# EAGLE design Aquaduino_mega32_u4_v1.5 (EAGLE 7.5.0)
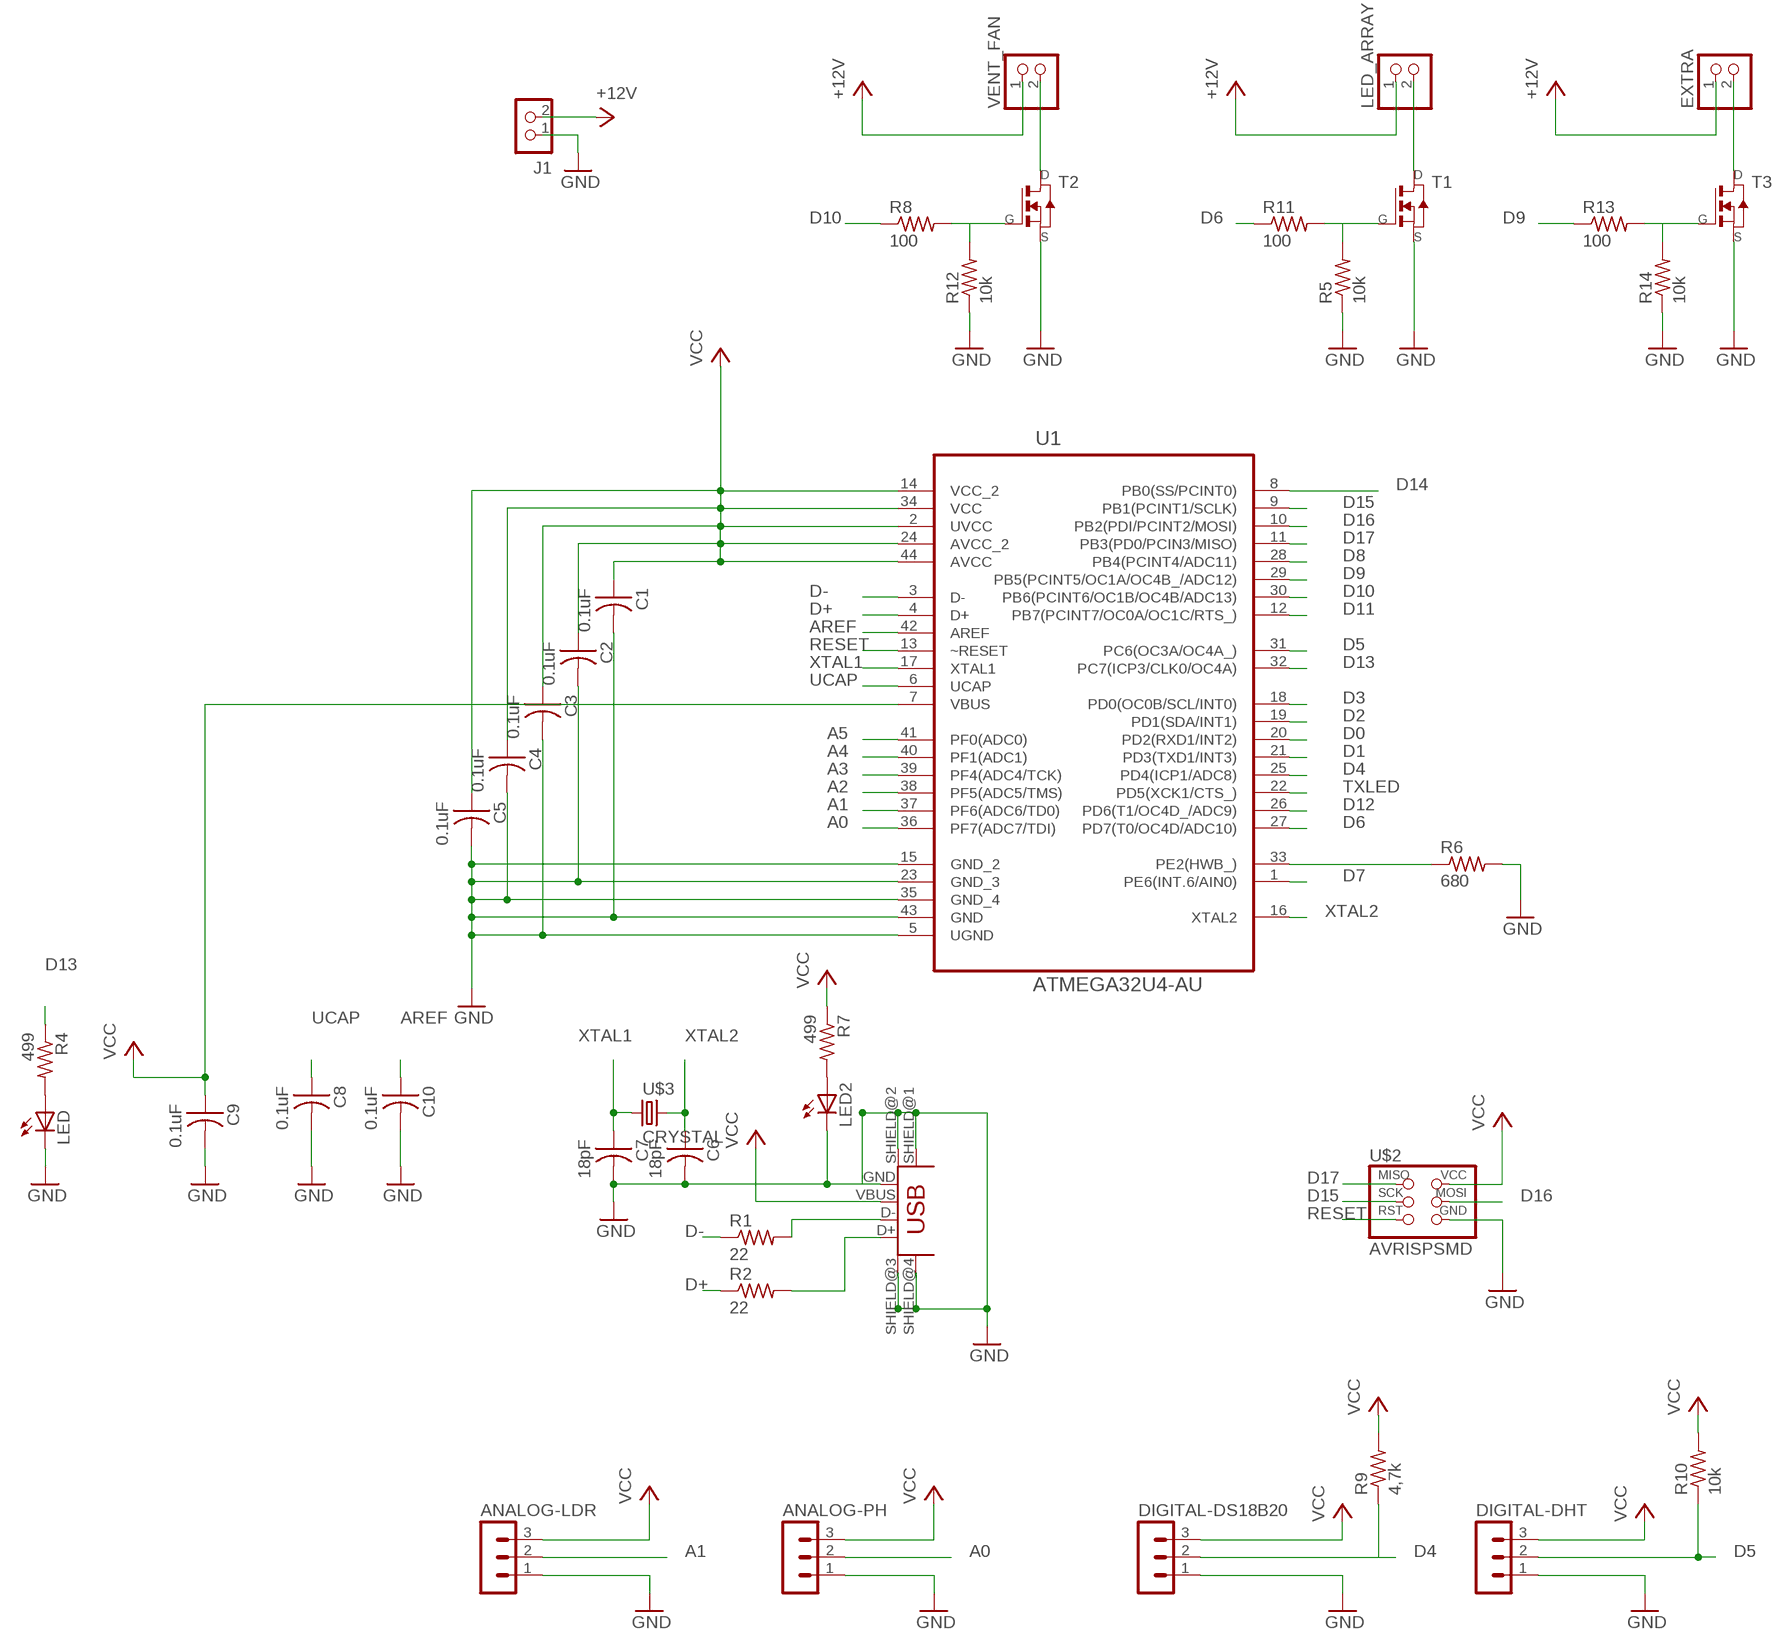
[diagram p0: schematic, sheet 1]

## Parts
ANALOG-LDR  MA03-1  [MA03-1]
ANALOG-PH  MA03-1  [MA03-1]
C1  0.1uF  CAP-US1206FAB  [C1206FAB]
C2  0.1uF  CAP-US1206FAB  [C1206FAB]
C3  0.1uF  CAP-US1206FAB  [C1206FAB]
C4  0.1uF  CAP-US1206FAB  [C1206FAB]
C5  0.1uF  CAP-US1206FAB  [C1206FAB]
C6  18pF  CAP-US1206FAB  [C1206FAB]
C7  18pF  CAP-US1206FAB  [C1206FAB]
C8  0.1uF  CAP-US1206FAB  [C1206FAB]
C9  0.1uF  CAP-US1206FAB  [C1206FAB]
C10  0.1uF  CAP-US1206FAB  [C1206FAB]
DIGITAL-DHT  MA03-1  [MA03-1]
DIGITAL-DS18B20  MA03-1  [MA03-1]
EXTRA  PINHD-1X2  [1X02]
J1  CON_TERMINAL_BLOCK_02-5MM  [TERMINAL_BLOCK_2P_5]
LED  LED1206  [1206]
LED2  LED1206  [1206]
LED_ARRAY  PINHD-1X2  [1X02]
R1  22  RES-US1206FAB  [R1206FAB]
R2  22  RES-US1206FAB  [R1206FAB]
R4  499  RESISTOR1206  [1206]
R5  10k  RES-US1206FAB  [R1206FAB]
R6  680  RES-US1206FAB  [R1206FAB]
R7  499  RESISTOR1206  [1206]
R8  100  RES-US1206FAB  [R1206FAB]
R9  4,7k  RES-US1206FAB  [R1206FAB]
R10  10k  RES-US1206FAB  [R1206FAB]
R11  100  RES-US1206FAB  [R1206FAB]
R12  10k  RES-US1206FAB  [R1206FAB]
R13  100  RES-US1206FAB  [R1206FAB]
R14  10k  RES-US1206FAB  [R1206FAB]
T1  NMOSFETTO252  [TO252]
T2  NMOSFETTO252  [TO252]
T3  NMOSFETTO252  [TO252]
U1  ATMEGA32U4-AU  [QFP80P1200X1200X120-44N]
U$1  USB_MINIB  [USB_MINIB]
U$2  AVRISPSMD  [2X03SMD]
U$3  CRYSTAL  [2-SMD-5X3MM]
VENT_FAN  PINHD-1X2  [1X02]

## Nets
A0: ANALOG-PH.2 U1.36(PF7(ADC7/TDI))
A1: ANALOG-LDR.2 U1.37(PF6(ADC6/TD0))
A2: U1.38(PF5(ADC5/TMS))
A3: U1.39(PF4(ADC4/TCK))
A4: U1.40(PF1(ADC1))
A5: U1.41(PF0(ADC0))
AREF: C10.1 U1.42(AREF)
D0: U1.20(PD2(RXD1/INT2))
D1: U1.21(PD3(TXD1/INT3))
D2: U1.19(PD1(SDA/INT1))
D3: U1.18(PD0(OC0B/SCL/INT0))
D4: DIGITAL-DS18B20.2 R9.1 U1.25(PD4(ICP1/ADC8))
D5: DIGITAL-DHT.2 R10.1 U1.31(PC6(OC3A/OC4A_))
D6: R11.1 U1.27(PD7(T0/OC4D/ADC10))
D7: U1.1(PE6(INT.6/AIN0))
D8: U1.28(PB4(PCINT4/ADC11))
D9: R13.1 U1.29(PB5(PCINT5/OC1A/OC4B_/ADC12))
D10: R8.1 U1.30(PB6(PCINT6/OC1B/OC4B/ADC13))
D11: U1.12(PB7(PCINT7/OC0A/OC1C/RTS_))
D12: U1.26(PD6(T1/OC4D_/ADC9))
D13: R4.1 U1.32(PC7(ICP3/CLK0/OC4A))
D14: U1.8(PB0(SS/PCINT0))
D15: U1.9(PB1(PCINT1/SCLK)) U$2.3(SCK)
D16: U1.10(PB2(PDI/PCINT2/MOSI)) U$2.4(MOSI)
D17: U1.11(PB3(PD0/PCIN3/MISO)) U$2.1(MISO)
D+: R2.1 U1.4(D+)
D-: R1.1 U1.3(D-)
GND: ANALOG-LDR.1 ANALOG-PH.1 C1.2 C2.2 C3.2 C4.2 C5.2 C6.2 C7.2 C8.2 C9.2 C10.2 DIGITAL-DHT.1 DIGITAL-DS18B20.1 J1.1 LED2.2(C) LED.2(C) R5.1 R6.2 R12.1 R14.1 T1.2(S) T2.2(S) T3.2(S) U1.5(UGND) U1.15(GND_2) U1.23(GND_3) U1.35(GND_4) U1.43(GND) U$1.GND U$1.SHIELD@1(SHIELD) U$1.SHIELD@2(SHIELD1) U$1.SHIELD@3(SHIELD2) U$1.SHIELD@4(SHIELD3) U$2.6(GND)
N$1: R1.2 U$1.D-
N$2: R2.2 U$1.D+
N$3: LED.1(A) R4.2
N$4: R8.2 R12.2 T2.1(G)
N$5: LED2.1(A) R7.2
N$6: T2.3(D) VENT_FAN.2
N$7: R13.2 R14.2 T3.1(G)
N$8: R5.2 R11.2 T1.1(G)
N$9: LED_ARRAY.2 T1.3(D)
N$10: EXTRA.2 T3.3(D)
N$35: R6.1 U1.33(PE2(HWB_))
RESET: U1.13(~RESET) U$2.5(RST)
TXLED: U1.22(PD5(XCK1/CTS_))
UCAP: C8.1 U1.6(UCAP)
VCC: ANALOG-LDR.3 ANALOG-PH.3 C1.1 C2.1 C3.1 C4.1 C5.1 C9.1 DIGITAL-DHT.3 DIGITAL-DS18B20.3 EXTRA.1 J1.2 LED_ARRAY.1 R7.1 R9.2 R10.2 U1.2(UVCC) U1.7(VBUS) U1.14(VCC_2) U1.24(AVCC_2) U1.34(VCC) U1.44(AVCC) U$1.VBUS U$2.2(VCC) VENT_FAN.1 ; supply symbol labelled +12V
XTAL1: C7.1 U1.17(XTAL1) U$3.P$1
XTAL2: C6.1 U1.16(XTAL2) U$3.P$2

## Library data of the parts
ANALOG-LDR ANALOG-PH DIGITAL-DHT DIGITAL-DS18B20 = con-lstb:MA03-1: PIN HEADER; OC_FARNELL: unknown; OC_NEWARK: unknown
C1-C10 = fab:CAP-US
EXTRA LED_ARRAY VENT_FAN = pinhead:PINHD-1X2: PIN HEADER
J1 = dp_devices:CON_TERMINAL_BLOCK_02: 2 poles wire to board terminal block
LED LED2 = ng:LED
R1 R2 R5 R6 R8-R14 = fab:RES-US: Resistor (US Symbol) Variants with postfix FAB are widened to allow the routing of internal traces
R4 R7 = ng:RESISTOR
T1-T3 = fab:NMOSFET: MOS FET
U1 = Atmel_By_element14_Batch_1:ATMEGA32U4-AU: 8-bit Microcontroller with ISP Flash and USB Controller; MPN: ATMEGA32U4-AU; OC_FARNELL: 1748525; OC_NEWARK: 26R5633; PACKAGE: TQFP-44; SUPPLIER: Atmel
U$1 = fab:USB_MINIB
U$2 = fab:AVRISP
U$3 = fab:CRYSTAL

## Net classes
0 default: width 0.254 mm, drill 0.406 mm, clearance 0.254 mm

## Board
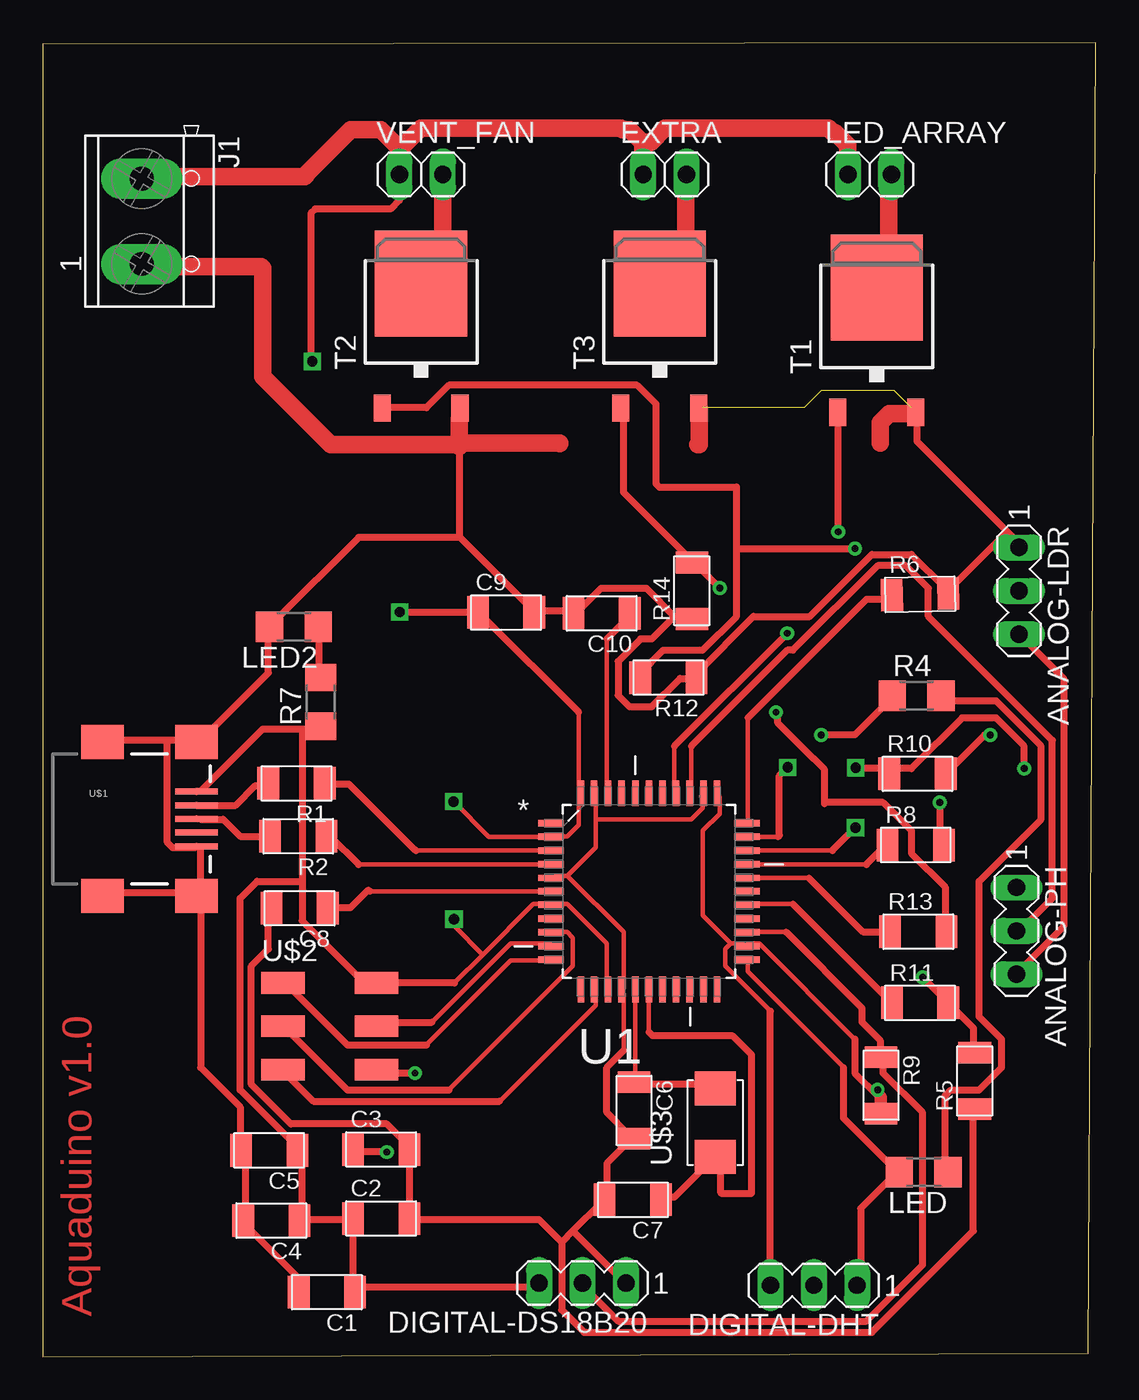
[diagram p1: board, top side]
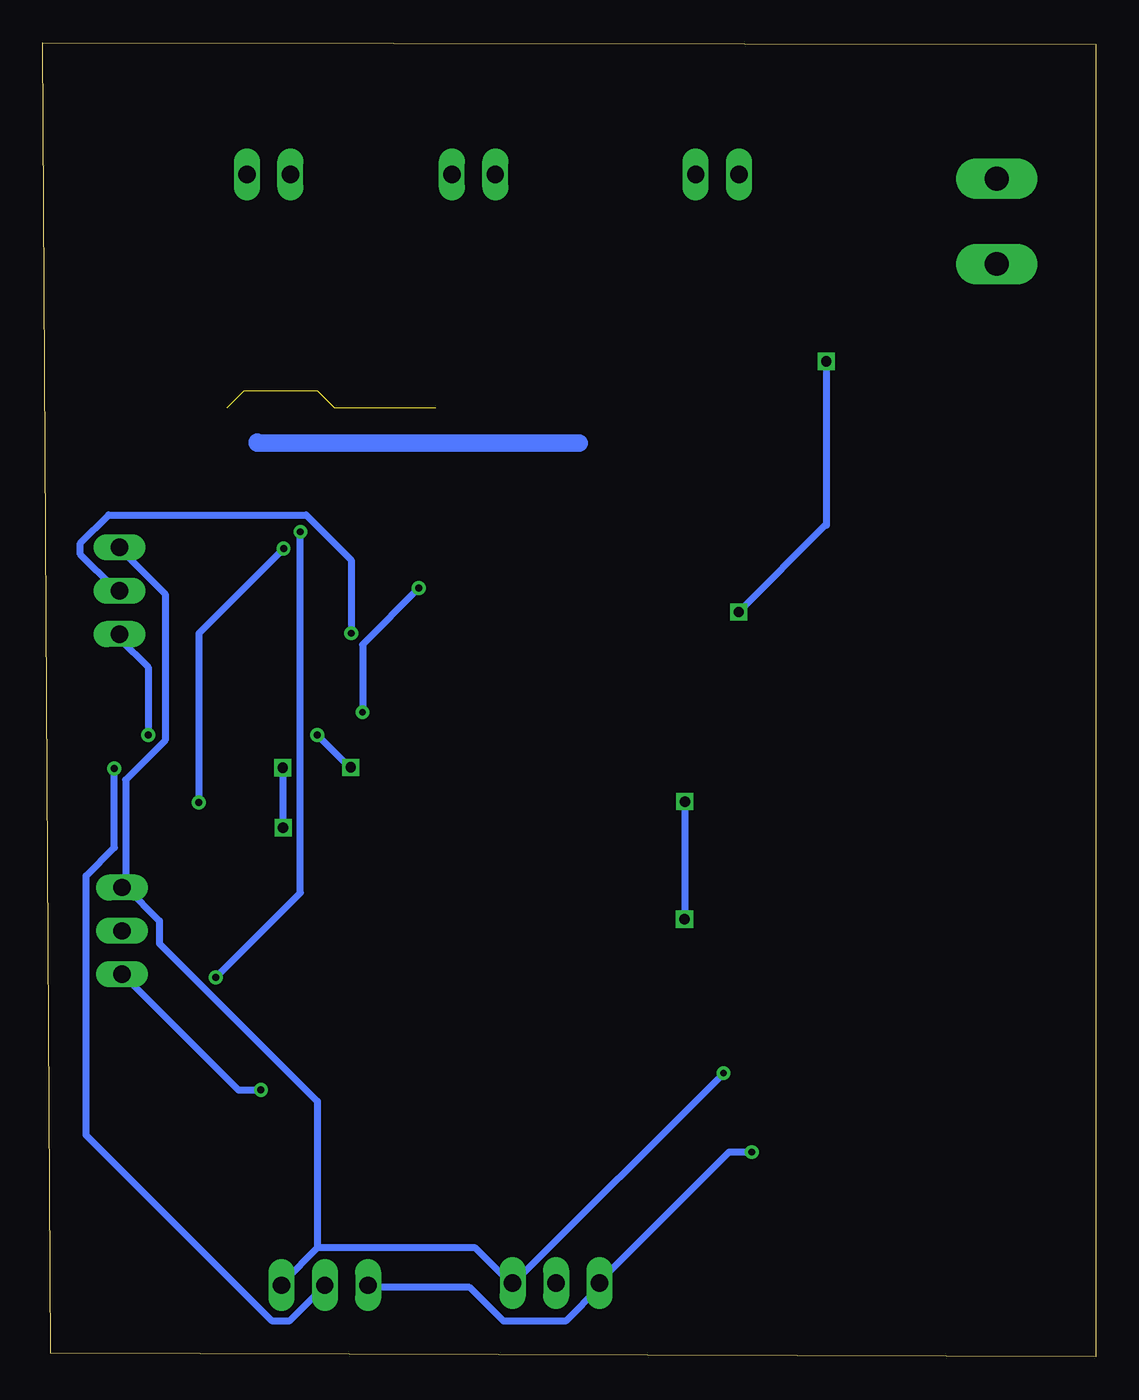
[diagram p2: board, bottom side, seen from below]

Size 61.65 x 76.95 mm. Coordinates in mm from the lower left corner, seen from the top.
Outline: 0,0 61.19,0.2 61.65,76.95 0,76.85 0,0
Copper layers (1*16): Top 0.035mm / dielectric 1.5mm / Bottom 0.035mm
Design rules "default *": minimum track width 10mil, minimum drill 16mil, track to track 10mil, track to pad 10mil, pad to pad 10mil, via to via 10mil, smd to smd 10mil, copper to edge 40mil, drill to drill 10mil, minimum pad ring 10mil, minimum via ring 8mil, stop-mask expansion 4mil, vias tented up to drill 0mil, thermal gap 10mil

### Footprints (pad centres in the part's own frame; a part is rotated, then mirrored left to right if it is on the bottom)
MA03-1 = drill 1.016 long: 1 -2.54,0; 2 0,0; 3 2.54,0
C1206FAB = smd 1.27 x 1.905: 1 -1.651,0; 2 1.651,0
1X02 = drill 1.016 long: 1 -1.27,0; 2 1.27,0
TERMINAL_BLOCK_2P_5 = drill 1.4 pad 2.38 long: 1 2.5,-0.45; 2 -2.5,-0.45
1206 = smd 1.6 x 1.803: 1 -1.422,0; 2 1.422,0
R1206FAB = smd 1.27 x 1.905: 1 -1.651,0; 2 1.651,0
TO252 = smd 1 x 1.6: 1 -2.28,-4.8; 2 2.28,-4.8 | smd 5.4 x 6.2: 3 0,2.5
QFP80P1200X1200X120-44N = smd 1.5 x 0.38: 1 -5.74,3.988; 2 -5.74,3.2; 3 -5.74,2.388; 4 -5.74,1.6; 5 -5.74,0.787; 6 -5.74,0; 7 -5.74,-0.787; 8 -5.74,-1.6; 9 -5.74,-2.388; 10 -5.74,-3.2; 11 -5.74,-3.988; 23 5.74,-3.988; 24 5.74,-3.2; 25 5.74,-2.388; 26 5.74,-1.6; 27 5.74,-0.787; 28 5.74,0; 29 5.74,0.787; 30 5.74,1.6; 31 5.74,2.388; 32 5.74,3.2; 33 5.74,3.988 | smd 0.38 x 1.5: 12 -3.988,-5.74; 13 -3.2,-5.74; 14 -2.388,-5.74; 15 -1.6,-5.74; 16 -0.787,-5.74; 17 0,-5.74; 18 0.787,-5.74; 19 1.6,-5.74; 20 2.388,-5.74; 21 3.2,-5.74; 22 3.988,-5.74; 34 3.988,5.74; 35 3.2,5.74; 36 2.388,5.74; 37 1.6,5.74; 38 0.787,5.74; 39 0,5.74; 40 -0.787,5.74; 41 -1.6,5.74; 42 -2.388,5.74; 43 -3.2,5.74; 44 -3.988,5.74
USB_MINIB = smd 2.5 x 0.35: D+ 3.77,0; D- 3.77,0.8; GND 3.77,-1.6; ID 3.77,-0.8; VBUS 3.77,1.6 | smd 2.5 x 2: SHIELD@1 -1.73,-4.5; SHIELD@2 -1.73,4.5; SHIELD@3 3.77,4.5; SHIELD@4 3.77,-4.5
2X03SMD = smd 2.54 x 1.27: 1 -2.54,2.54; 2 2.92,2.54; 3 -2.54,0; 4 2.92,0; 5 -2.54,-2.54; 6 2.92,-2.54
2-SMD-5X3MM = smd 2 x 2.4: P$1 -2,0; P$2 2,0

### Placement (x,y rotation side)
ANALOG-LDR  57.15,44.86 270 top
ANALOG-PH  57,24.94 270 top
C1  16.64,3.78 180 top
C2  19.81,8.1 0 top
C3  19.81,12.14 0 top
C4  13.39,7.98 180 top
C5  13.26,12.09 180 top
C6  34.62,14.43 270 top
C7  34.54,9.19 180 top
C8  15.04,26.26 180 top
C9  27.13,43.59 0 top
C10  32.72,43.54 180 top
DIGITAL-DHT  45.14,4.19 180 top
DIGITAL-DS18B20  31.6,4.32 180 top
EXTRA  36.42,69.24 0 top
J1  6.25,66.5 270 top
LED  51.56,10.82 180 top
LED2  14.71,42.75 180 top
LED_ARRAY  48.41,69.24 0 top
R1  14.86,33.58 180 top
R2  14.96,30.48 180 top
R4  51.16,38.71 0 top
R5  54.56,16.15 90 top
R6  51.36,44.65 1.2 top
R7  16.28,38.35 90 top
R8  51.1,29.97 0 top
R9  49.07,15.9 270 top
R10  51.21,34.14 0 top
R11  51.36,20.73 0 top
R12  36.63,39.78 180 top
R13  51.26,24.89 0 top
R14  38,44.86 90 top
T1  48.82,60.1 0 top
T2  22.15,60.35 0 top
T3  36.12,60.35 0 top
U1  35.48,27.25 0 top
U$1  5.23,31.5 0 top
U$2  16.61,19.35 0 top
U$3  39.37,13.72 90 top
VENT_FAN  22.15,69.24 0 top

### Tracks (layer width: path | path; a pad name or v marks a point on that pad's centre or on a via)
A0
  Top 0.254: 37.97,35.76 37.97,33.12 U1.36
  Top 0.406: 37.97,35.76 43.59,41.38 43.92,41.38 48.87,46.33 50.52,46.33 51.84,45.01 51.84,43.36 59.11,36.09 59.11,26.85 57.12,24.87 ANALOG-PH.2
A1  (via drill 0.41)
  Top 0.254: 36.98,35.76 36.98,33.12 U1.37
  Top 0.406: v43.59,42.37 36.98,35.76
  Bottom 0.406: v43.59,42.37 43.59,46.66 46.23,49.3 57.78,49.3 59.44,47.65 59.44,46.99 57.45,45.01 ANALOG-LDR.2
AREF
  Top 0.254: 33.02,42.04 33.02,33.12 U1.42
  Top 0.406: 33.02,42.04 34.34,43.36 C10.1
D4
  Top 0.254: U1.25 43.51,24.87
  Top 0.406: DIGITAL-DS18B20.2 31.7,4.06 33.68,2.08 48.21,2.08 51.51,5.38 51.51,14.3 49.2,16.61 49.2,17.27 R9.1 49.02,17.6 49.02,18.54 47.95,19.61 47.95,20.42 43.51,24.87
D5  (via drill 0.41, 0.6)
  Top 0.254: U1.31 46.23,29.64
  Top 0.406: v57.45,34.44 57.45,35.76 55.8,37.41 53.82,37.41 50.85,34.44 49.86,34.44 R10.1 49.2,34.49 v47.6,34.49 | 46.23,29.64 v47.57,30.99
  Bottom 0.406: v57.45,34.44 57.45,29.82 59.11,28.17 59.11,12.98 48.21,2.08 47.22,2.08 45.24,4.06 DIGITAL-DHT.2 | v47.57,30.99 47.57,34.47 v47.6,34.49
D6
  Top 0.254: 43.92,26.52 41.27,26.52 U1.27
  Top 0.406: R11.1 43.92,26.52
D9
  Top 0.254: U1.29 44.86,28.04
  Top 0.406: 44.86,28.04 48.01,24.89 R13.1
D10
  Top 0.254: 48.21,28.83 41.27,28.83
  Top 0.406: 48.21,28.83 49.2,29.82 R8.1 | 41.27,28.83 U1.30
D13  (via drill 0.41, 0.6)
  Top 0.254: U1.32 43.05,30.45
  Top 0.406: v45.57,36.42 47.55,36.42 49.53,38.4 R4.1 | 43.05,30.45 43.13,30.53 43.13,34.04 v43.61,34.52
  Bottom 0.406: v43.61,34.52 43.66,34.52 v45.57,36.42
D15
  Top 0.254: U1.9 30.71,24.87 31.04,24.54 31.04,22.89 23.77,15.62
  Top 0.406: 23.77,15.62 17.83,15.62 14.2,19.25 U$2.3
D16
  Top 0.254: 22.78,19.58 27.41,24.21 29.72,24.21 U1.10
  Top 0.406: 22.78,19.58 19.81,19.58 U$2.4
D17
  Top 0.254: 29.72,23.22 27.41,23.22 22.45,18.26
  Top 0.406: 22.45,18.26 17.83,18.26 14.2,21.89 U$2.1 | 29.72,23.22 U1.11
D+
  Top 0.254: 18.49,28.83 29.72,28.83
  Top 0.406: 18.49,28.83 16.84,30.48 R2.1 | 29.72,28.83 U1.4
D-
  Top 0.254: U1.3 21.84,29.64
  Top 0.406: 21.84,29.64 21.79,29.69 21.77,29.69 17.93,33.53 16.56,33.53 R1.1
GND  (via drill 0.41)  (4 unrouted)
  Top 0.254: 41.27,23.22 41.27,22.55 46.89,16.94 | 30.71,28.17 30.05,28.17 U1.5 | 30.71,28.17 32.36,29.82 32.36,31.47 | 32.36,31.47 32.36,32.79 U1.43 | 30.71,28.17 34.01,24.87 34.01,21.56 U1.15 34.01,21.23 34.01,17.93 | 38.63,32.79 38.63,32.13 37.97,31.47 32.36,31.47
  Top 0.406: 46.89,16.94 46.89,13.97 49.86,11 LED.2 49.86,10.67 47.88,8.69 47.88,4.39 DIGITAL-DHT.1 | 41.27,23.22 U1.23 | v21.79,16.61 19.81,16.61 U$2.6 | C8.2 13.21,26.19 13.21,23.88 12.22,22.89 12.22,15.95 14.53,13.64 20.14,13.64 21.46,12.32 C3.2 C2.2 21.46,8.03 29.06,8.03 30.38,6.71 | 38.63,32.79 U1.35 | 30.38,6.71 30.38,2.74 31.7,1.42 48.54,1.42 54.48,7.37 54.48,14.3 R5.1 | 31.04,7.37 32.69,9.02 C7.2 33.02,9.35 33.02,11.33 34.34,12.65 C6.2 34.34,12.98 33.02,14.3 33.02,16.94 34.01,17.93 | 31.04,7.37 30.38,6.71 | 31.04,7.37 34.01,4.39 DIGITAL-DS18B20.1 | C1.2 14.86,4.06 14.86,4.72 11.89,7.7 C4.2 11.89,8.03 11.89,11.99 C5.2 11.56,12.32 11.56,14.63 9.25,16.94 9.25,26.85 U$1.SHIELD@4 | U$1.SHIELD@1 3.63,27.18 8.92,27.18 U$1.SHIELD@4 | U$1.SHIELD@4 9.25,27.18 9.25,29.82 U$1.GND 8.92,29.82 7.59,29.82 7.26,30.15 7.26,36.09 | 7.26,36.09 8.92,36.09 U$1.SHIELD@3 9.25,36.09 13.21,40.06 13.21,42.7 LED2.2 13.54,43.03 18.49,47.98 24.43,47.98 | 7.26,36.09 3.63,36.09 U$1.SHIELD@2 | 56.46,48.31 57.12,47.65 ANALOG-LDR.1 | 56.46,48.31 51.18,53.59 51.18,55.24 T1.2 50.85,55.57 | 38.63,55.57 T3.2 | 56.46,48.31 53.16,45.01 R6.2 52.83,45.01 50.85,46.99 48.54,46.99 44.91,43.36 41.6,43.36 38.3,40.06 R12.1 37.97,39.73 37.31,39.73 35.66,38.07 34.34,38.07 33.68,38.73 33.68,40.72 35,42.04 35.66,42.04 36.98,43.36 | 24.43,54.97 24.43,55.24 T2.2 | 24.43,47.98 28.73,43.69 C9.2 29.06,43.69 31.04,43.69 C10.2 31.37,43.69 32.69,45.01 35.33,45.01 36.98,43.36 | 36.98,43.36 37.97,43.36 R14.1 | 24.38,53.31 24.38,48.03 24.43,47.98
  Top 1.016: J1.1 5.94,63.83 12.8,63.83 12.88,63.75 12.88,57.4 16.87,53.42 24.28,53.42 24.38,53.31 24.38,54.91 24.43,54.97
  Bottom 0.406: v21.79,16.61 34.01,4.39 DIGITAL-DS18B20.1 34.34,4.39 36.32,6.38 45.57,6.38 | 45.57,6.38 47.55,4.39 DIGITAL-DHT.1 | 56.79,27.51 56.79,33.78 54.48,36.09 54.48,44.68 57.12,47.32 ANALOG-LDR.1 | 45.57,6.38 45.57,14.96 54.81,24.21 54.81,25.53 56.79,27.51 | 56.79,27.51 ANALOG-PH.1
N$1
  Top 0.406: U$1.D- 11.29,32.3 12.45,33.45 13.08,33.45 R1.2
N$2
  Top 0.406: R2.2 11.56,30.48 10.57,31.47 9.25,31.47 U$1.D+
N$3
  Top 0.406: R4.2 52.83,38.4 55.8,38.4 58.44,35.76 58.44,31.47 54.81,27.84 54.81,19.91 56.13,18.59 56.13,16.94 54.81,15.62 53.16,15.62 52.83,15.29 52.83,11 LED.1
N$4  (via drill 0.41)
  Top 0.406: 40.61,47.32 40.61,43.36 38.63,41.38 36.32,41.38 35,40.06 R12.2 | 40.61,47.32 40.61,50.95 40.59,50.93 36.09,50.93 35.89,51.13 35.89,55.8 34.8,56.9 23.77,56.9 22.45,55.57 20.14,55.57 T2.1 | v52.5,32.46 52.5,30.15 R8.2 | 40.61,47.32 v47.55,47.32
  Bottom 0.406: v52.5,32.46 52.5,42.37 v47.55,47.32
N$5
  Top 0.406: LED2.1 16.18,42.7 16.18,40.06 R7.2
N$6
  Top 1.016: VENT_FAN.2 23.42,63.12 23.17,62.86 22.16,62.86 T2.3
N$7  (via drill 0.41)
  Top 0.406: T3.1 34.01,55.24 34.01,50.62 37.97,46.66 R14.2 38.3,46.33 v39.62,45.01 | R13.2 52.83,25.2 52.83,27.51 50.85,29.49 50.85,30.81 49.2,32.46 45.85,32.46 45.77,32.38 45.77,34.39 45.14,35.03 45.11,35.03 43.03,37.11 43.03,37.64 v42.93,37.74
  Bottom 0.406: v42.93,37.74 42.93,41.71 v39.62,45.01
N$8  (via drill 0.41)
  Top 0.406: v46.56,48.31 46.56,55.24 T1.1 | v51.51,22.22 R11.2 54.48,19.25 54.48,17.93 R5.2
  Bottom 0.406: v46.56,48.31 46.56,27.18 v51.51,22.22
N$9
  Top 0.406: 49.53,63.5 48.87,62.84 T1.3 | 49.53,69.11 LED_ARRAY.2
  Top 1.016: 49.53,69.11 49.53,63.5
N$10
  Top 0.406: 37.64,64.49 36.32,63.17 T3.3 | 37.64,69.11 EXTRA.2
  Top 1.016: 37.64,69.11 37.64,64.49
N$13
  Top 1.016: 24.36,53.49 30.28,53.49 30.28,53.47
N$15
  Bottom 1.016: 30.25,53.52 49.1,53.52 49.1,53.57
N$16
  Top 1.016: 38.35,53.42 38.43,53.42 38.43,55.55
N$17
  Top 1.016: 49.02,53.52 49.02,54.71 49.55,55.24 51.03,55.24
N$35
  Top 0.254: 41.27,37.41 41.27,31.14 U1.33
  Top 0.406: 41.27,37.41 48.21,44.35 49.53,44.35 R6.1
RESET
  Top 0.254: 26.75,14.96 32.36,20.57 32.36,21.23 U1.13
  Top 0.406: 26.75,14.96 15.85,14.96 14.2,16.61 U$2.5
UCAP
  Top 0.254: U1.6 19.15,27.25
  Top 0.406: 19.15,27.25 19.1,27.3 19.03,27.3 18.01,26.29 16.71,26.29 C8.1
VCC  (via drill 0.41, 0.6)
  Top 0.254: U1.14 33.02,21.56 33.02,24.21 30.71,26.52 30.05,26.52 U1.7 29.72,26.52 28.73,26.52 25.76,23.55 | 25.76,23.55 24.11,21.89 | 30.05,30.48 30.71,30.48 31.37,31.14 31.37,32.79 U1.44 31.37,33.12 31.37,37.74 | 40.28,24.21 38.63,25.86 38.63,30.81 39.62,31.8 39.62,32.79 U1.34 | 40.28,24.21 40.94,24.21 U1.24 41.27,24.21 41.94,24.21 47.55,18.59 | 40.28,24.21 39.95,23.88 39.95,22.89 42.6,20.24 | U1.2 26.11,30.45 v24.05,32.51 | v24.08,25.63 24.08,25.22 25.76,23.55
  Top 0.406: 24.11,21.89 U$2.2 18.82,21.89 15.19,25.53 15.19,27.84 | 30.05,30.48 U1.2 | 15.19,36.75 12.88,36.75 9.25,33.12 U$1.VBUS | 15.19,36.75 16.18,36.75 R7.1 | 31.37,37.74 25.76,43.36 C9.1 25.45,43.61 v20.9,43.61 | 15.19,36.75 15.19,27.84 | 47.55,18.59 47.55,16.61 48.87,15.29 48.87,14.3 R9.2 49.2,14.3 49.2,15.29 v48.87,15.62 | 18.16,8.03 15.19,8.03 | 15.19,8.03 15.19,11.99 C5.1 14.86,12.32 11.56,15.62 11.56,26.85 12.55,27.84 15.19,27.84 | 15.19,8.03 C4.1 | 18.16,8.03 18.16,4.06 C1.1 18.49,4.06 29.06,4.06 DIGITAL-DS18B20.3 | 18.16,8.03 C2.1 | v20.14,11.99 18.16,11.99 C3.1 | DIGITAL-DHT.3 42.6,20.24 | R10.2 55.14,36.42 v55.47,36.42 | ANALOG-PH.3 57.12,22.55 59.77,25.2 59.77,39.73 57.45,42.04 ANALOG-LDR.3 | 20.85,69.27 VENT_FAN.1 20.88,67.72 20.37,67.21 15.95,67.21 15.7,66.95 15.7,58.37 v15.77,58.29
  Top 1.016: J1.2 5.94,69.11 15.34,69.11 15.42,69.19 15.42,69.24 18.03,71.86 19.79,71.86 20.85,70.79 20.85,69.27 | VENT_FAN.1 20.88,70.74 20.83,70.79 20.98,70.79 22.12,71.93 33.86,71.93 33.93,71.86 34.37,71.86 35.13,71.09 35.13,69.27 EXTRA.1 | EXTRA.1 35.15,69.21 | EXTRA.1 35.15,71.09 35.13,71.12 35.61,71.12 36.42,71.93 46,71.93 46.25,71.68 46.38,71.68 47.12,70.94 47.12,69.27 LED_ARRAY.1
  Bottom 0.406: v20.14,11.99 21.46,11.99 29.06,4.39 DIGITAL-DS18B20.3 29.06,4.06 31.04,2.08 34.67,2.08 36.65,4.06 42.6,4.06 DIGITAL-DHT.3 | v55.47,36.42 55.47,40.39 57.12,42.04 ANALOG-LDR.3 57.45,42.37 | v48.87,15.62 50.19,15.62 56.79,22.22 ANALOG-PH.3 | v24.05,32.51 24.05,25.65 v24.08,25.63 | v15.77,58.29 15.77,48.69 15.82,48.69 v20.9,43.61
XTAL1
  Top 0.254: U1.17 35.48,19.02
  Top 0.406: C7.1 36.32,9.35 36.98,9.35 39.29,11.66 U$3.P$1 39.7,11.39 39.7,9.6 39.75,9.55 41.45,9.55 41.48,9.58 41.48,17.7 40.36,18.82 35.69,18.82 35.48,19.02
XTAL2
  Top 0.254: U1.16 34.7,16.15
  Top 0.406: U$3.P$2 39.29,15.95 34.67,15.95 C6.1 34.7,16.15

### Text on the board
Top: Aquaduino v1.0